# Altium project di2c.PrjPcb
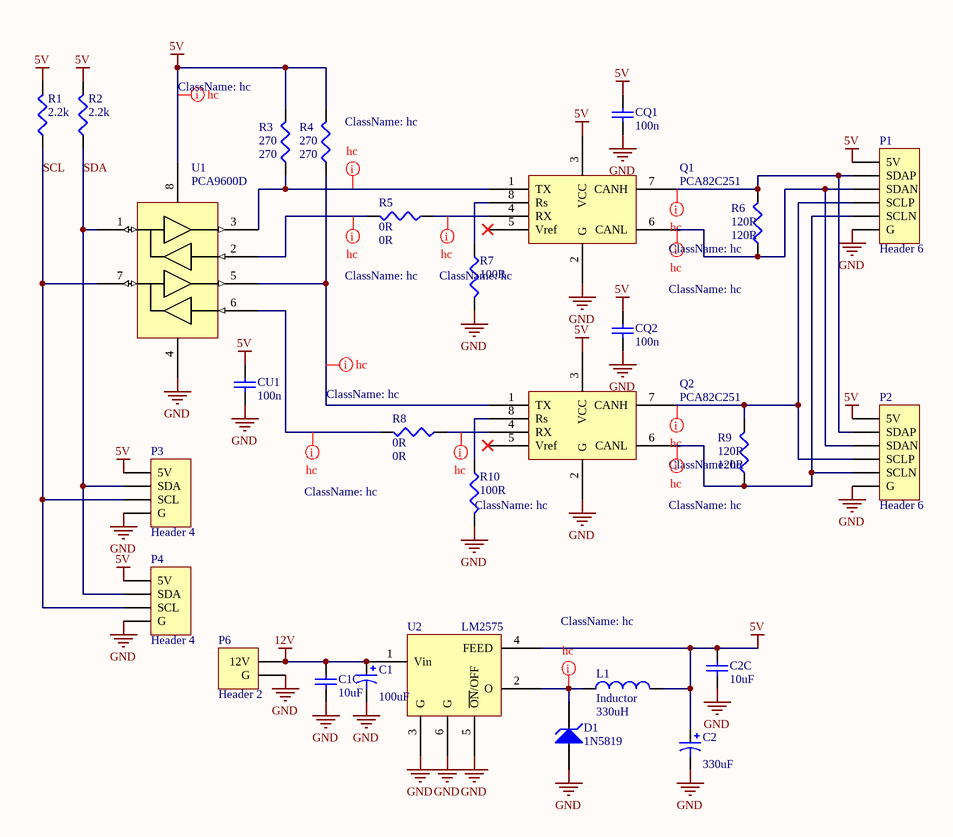
[diagram p0: di2c.SchDoc]
1 sheet, 28 parts. Net scope: global (net labels, ports and power ports of the same name join across sheets).
Board files: di2c.PcbDoc, di2cx2.PcbDoc

## Sheet di2c.SchDoc
size A3

### Parts
C1  value 100uF  [C7343]  (hidden comment: Cap Pol1)
C1C  value 10uF  [C1812]  (hidden comment: Cap Semi)
C2  value 330uF  [C7343]  (hidden comment: Cap Pol1)
C2C  value 10uF  [C1812]  (hidden comment: Cap Semi)
CQ1  value 100n  [C1206]  (hidden comment: Cap Semi)
CQ2  value 100n  [C1206]  (hidden comment: Cap Semi)
CU1  value 100n  [C1206]  (hidden comment: Cap Semi)
D1  1N5819  [DO214AC]
L1  Inductor  value 330uH  [CD74R]
P1  Header 6  [HDR1X6]
P2  Header 6  [HDR1X6]
P3  Header 4  [HDR1X4]
P4  Header 4  [HDR1X4]
P6  Header 2  [HDR1X2]
Q1  PCA82C251  [SOIC150-8_M]
Q2  PCA82C251  [SOIC150-8_M]
R1  2.2k  [J1-0603]
R2  2.2k  [J1-0603]
R3  270  [R1206]
R4  270  [R1206]
R5  0R  [R1206]
R6  120R  [R1206]
R7  100R  [J1-0603]
R8  0R  [R1206]
R9  120R  [R1206]
R10  100R  [J1-0603]
U1  PCA9600D  [SOIC150-8_M]
U2  LM2575  [KTT]

### Nets
5V: C2.1 C2C.2 CQ1.2 CQ2.2 CU1.2 L1.2 P1.6(5V) P2.6(5V) P3.4(5V) P4.4(5V) Q1.3(VCC) Q2.3(VCC) R1.2 R2.2 R3.2 R4.2 U1.8 U2.4(FEED)
12V: C1.1 C1C.2 P6.2(12V) U2.1(Vin)
GND: C1.2 C1C.1 C2.2 C2C.1 CQ1.1 CQ2.1 CU1.1 D1.2(A) P1.1(G) P2.1(G) P3.1(G) P4.1(G) P6.1(G) Q1.2(G) Q2.2(G) R7.2 R10.2 U1.4 U2.3(G) U2.5(~{ON}/OFF) U2.6(G)
SCL: P3.2(SCL) P4.2(SCL) R1.1 U1.7
SDA: P3.3(SDA) P4.3(SDA) R2.1 U1.1
NetD1_1: D1.1(K) L1.1 U2.2(O)
NetP1_2: P1.2(SCLN) P2.2(SCLN) Q2.6(CANL) R9.1
NetP1_3: P1.3(SCLP) P2.3(SCLP) Q2.7(CANH) R9.2
NetP1_4: P1.4(SDAN) P2.4(SDAN) Q1.6(CANL) R6.1
NetP1_5: P1.5(SDAP) P2.5(SDAP) Q1.7(CANH) R6.2
NetQ1_1: Q1.1(TX) R3.1 U1.3
NetQ1_4: Q1.4(RX) R5.1
NetQ1_8: Q1.8(Rs) R7.1
NetQ2_1: Q2.1(TX) R4.1 U1.5
NetQ2_4: Q2.4(RX) R8.1
NetQ2_8: Q2.8(Rs) R10.1
NetR5_2: R5.2 U1.2
NetR8_2: R8.2 U1.6

Not connected (* = marked no-connect by the designer): Q1 5(Vref)*; Q2 5(Vref)*

### Layout directives
net class hc: 5V, NetD1_1, NetP1_2, NetP1_3, NetP1_4, NetP1_5, NetQ1_1, NetQ1_4, NetQ2_1, NetQ2_4, NetR5_2, NetR8_2

### Library data of the parts
C1 C2 = Cap Pol1: Polarized Capacitor (Radial); Published: 8-Jun-2000; LatestRevisionDate: 17-Jul-2002; LatestRevisionNote: Re-released for DXP Platform.; PackageReference: RB7.6-15; Publisher: Altium Limited; PackageDescription: Polarized Capacitor (Radial); 2 Leads
C1C C2C CQ1 CQ2 CU1 = Cap Semi: Capacitor (Semiconductor SIM Model); Published: 8-Jun-2000; LatestRevisionDate: 29-May-2009; LatestRevisionNote: IPC-7351 Footprint Added.; PackageReference: C1206; Publisher: Altium Limited; PackageDescription: Chip Capacitor
D1 = D Zener: Zener Diode; Published: 8-Jun-2000; LatestRevisionDate: 17-Jul-2002; LatestRevisionNote: Re-released for DXP Platform.; PackageReference: DIODE-0.7; Publisher: Altium Limited; PackageDescription: Diode, Thru-Hole; 2 Leads; 0.7 in Pin Spacing
L1 = Inductor: Code_IEC: 1005; Published: 8-Jun-2000; LatestRevisionDate: 29-May-2009; LatestRevisionNote: IPC-7351 Footprint Added.; PackageReference: 0402-A; Publisher: Altium Limited; PackageDescription: Chip Inductor; Code_JEITA: 0402
P1 P2 = Header 6: Header, 6-Pin; LatestRevisionDate: 17-Jul-2002; LatestRevisionNote: Re-released for DXP Platform.; Publisher: Altium Limited
P3 P4 = Header 4: Header, 4-Pin; LatestRevisionDate: 17-Jul-2002; LatestRevisionNote: Re-released for DXP Platform.; Publisher: Altium Limited
P6 = Header 2: Header, 2-Pin; LatestRevisionDate: 17-Jul-2002; LatestRevisionNote: Re-released for DXP Platform.; Publisher: Altium Limited
R1-R10 = Res3: Resistor; Published: 8-Jun-2000; LatestRevisionDate: 29-May-2009; LatestRevisionNote: IPC-7351 Footprint Added.; PackageReference: J1-0603; Publisher: Altium Limited; PackageDescription: Chip Resistor
  R1 R2: Value: 2.2k
  R3 R4: Value: 270
  R5 R8: Value: 0R
  R6 R9: Value: 120R
  R7 R10: Value: 100R
U1 = P82B96